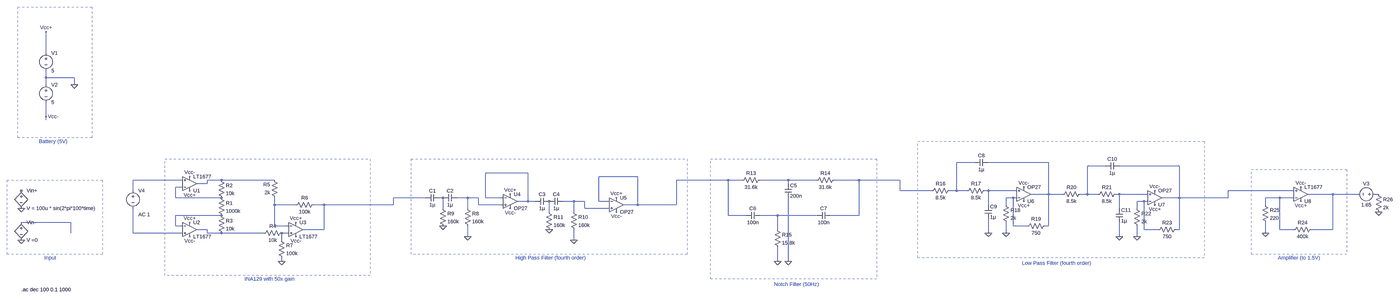
[diagram p0: schematic Prototype1.asc, whole sheet]
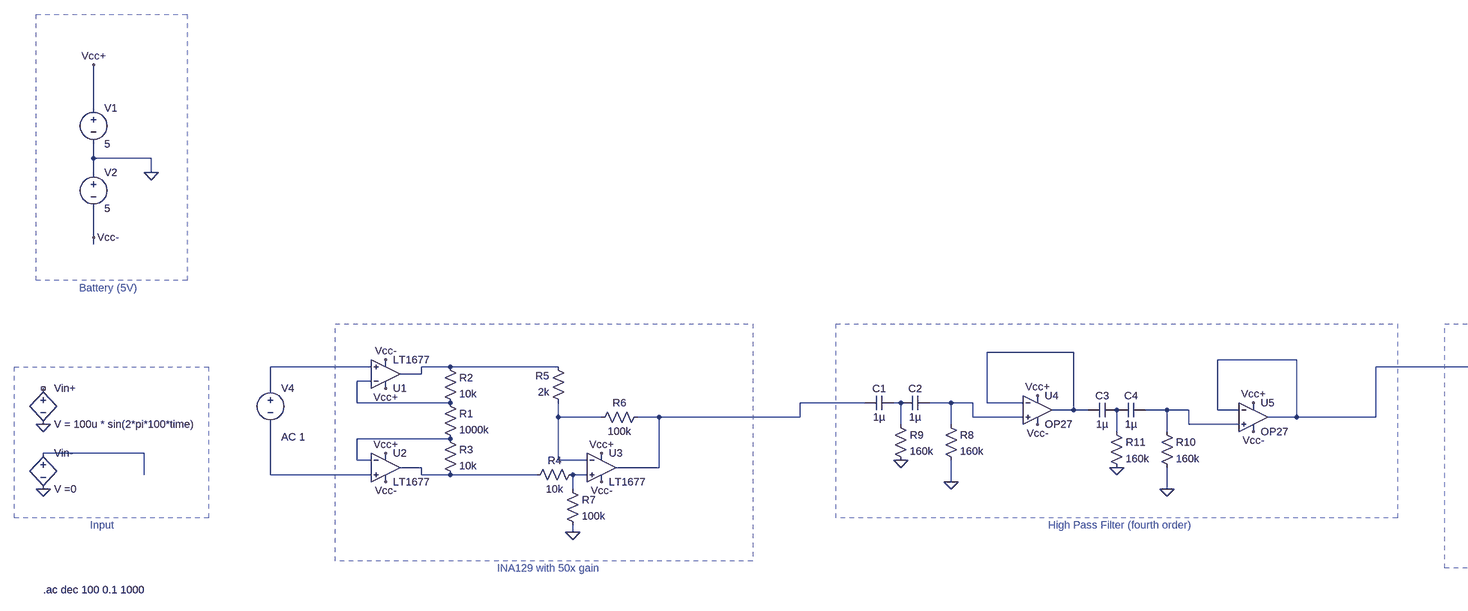
[diagram p1: schematic Prototype1.asc, part, row 1 of 1, column 1 of 2]
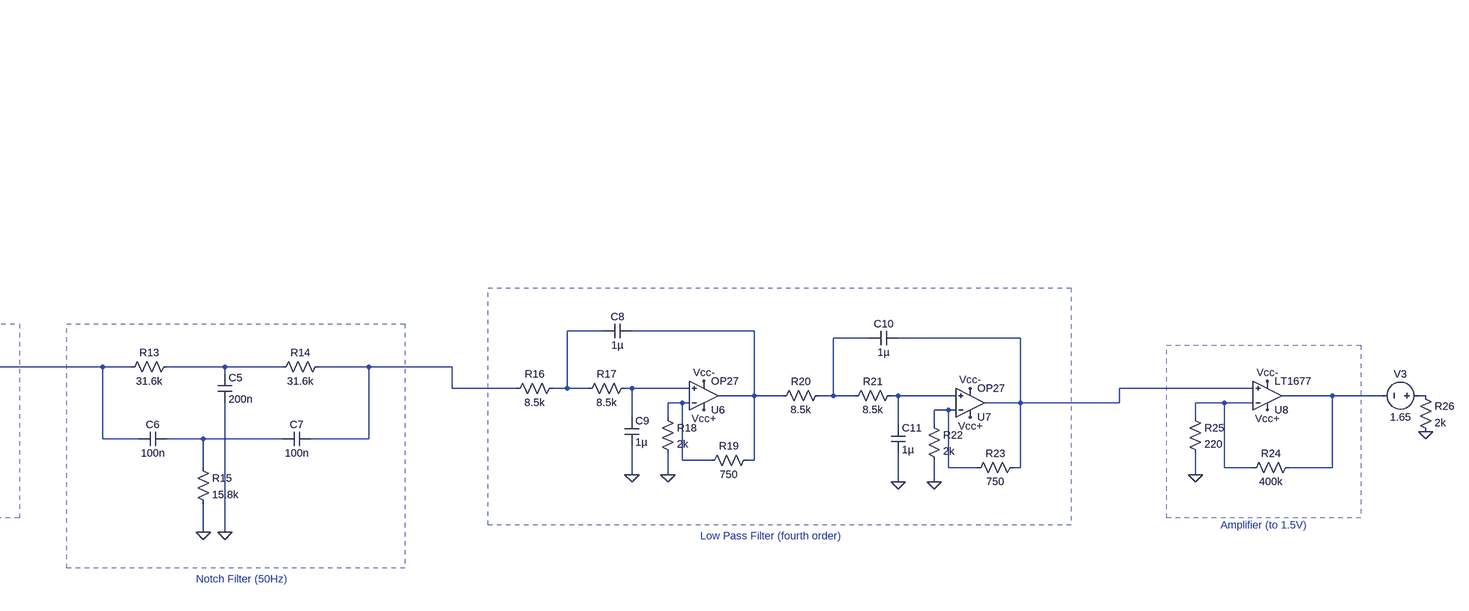
[diagram p2: schematic Prototype1.asc, part, row 1 of 1, column 2 of 2]
Prototype1.asc, the LTspice schematic file:
Version 4.1
SHEET 1 6180 680
WIRE -208 -640 -208 -736
WIRE -208 -528 -208 -560
WIRE -80 -528 -208 -528
WIRE -208 -496 -208 -528
WIRE -80 -496 -80 -528
WIRE -208 -352 -208 -416
WIRE -208 -336 -208 -352
WIRE 4160 -144 4080 -144
WIRE 4496 -144 4224 -144
WIRE 4752 -128 4672 -128
WIRE 5088 -128 4816 -128
WIRE 2064 -96 1872 -96
WIRE 2560 -80 2384 -80
WIRE 416 -64 192 -64
WIRE 592 -64 528 -64
WIRE 832 -64 592 -64
WIRE 3024 -64 2736 -64
WIRE 3088 -64 3024 -64
WIRE 3296 -64 3168 -64
WIRE 3424 -64 3296 -64
WIRE 3616 -64 3504 -64
WIRE 3824 -64 3616 -64
WIRE 528 -48 528 -64
WIRE 528 -48 480 -48
WIRE 3296 -48 3296 -64
WIRE 416 -32 384 -32
WIRE 192 -16 192 -64
WIRE 3824 -16 3824 -64
WIRE 3968 -16 3824 -16
WIRE 4080 -16 4080 -144
WIRE 4080 -16 4048 -16
WIRE 4128 -16 4080 -16
WIRE 4224 -16 4208 -16
WIRE 4352 -16 4224 -16
WIRE 5728 -16 5344 -16
WIRE 4496 0 4496 -144
WIRE 4496 0 4416 0
WIRE 4560 0 4496 0
WIRE 4672 0 4672 -128
WIRE 4672 0 4640 0
WIRE 4720 0 4672 0
WIRE 4816 0 4800 0
WIRE 4944 0 4816 0
WIRE 5904 0 5792 0
WIRE 6016 0 5904 0
WIRE 6112 0 6096 0
WIRE 384 16 384 -32
WIRE 592 16 384 16
WIRE 1600 16 1456 16
WIRE 1680 16 1664 16
WIRE 1792 16 1744 16
WIRE 1840 16 1792 16
WIRE 1872 16 1872 -96
WIRE 1952 16 1872 16
WIRE 4336 16 4304 16
WIRE 4352 16 4336 16
WIRE 5088 16 5088 -128
WIRE 5088 16 5008 16
WIRE 5344 16 5344 -16
WIRE 5344 16 5088 16
WIRE 5664 16 5600 16
WIRE 5728 16 5664 16
WIRE 2064 32 2064 -96
WIRE 2064 32 2016 32
WIRE 2096 32 2064 32
WIRE 2272 32 2224 32
WIRE 2320 32 2272 32
WIRE 2384 32 2384 -80
WIRE 2432 32 2384 32
WIRE 4928 32 4896 32
WIRE 4944 32 4928 32
WIRE 832 48 832 16
WIRE 928 48 832 48
WIRE 1056 48 1008 48
WIRE 1456 48 1456 16
WIRE 1456 48 1056 48
WIRE 1840 48 1840 16
WIRE 1952 48 1840 48
WIRE 2560 48 2560 -80
WIRE 2560 48 2496 48
WIRE 2736 48 2736 -64
WIRE 2736 48 2560 48
WIRE 4224 48 4224 -16
WIRE 4304 48 4304 16
WIRE 5600 48 5600 16
WIRE 1680 64 1680 16
WIRE 1792 64 1792 16
WIRE 2320 64 2320 32
WIRE 2432 64 2320 64
WIRE 4816 64 4816 0
WIRE 4896 64 4896 32
WIRE 2160 80 2160 32
WIRE 2272 80 2272 32
WIRE 592 96 384 96
WIRE 3024 96 3024 -64
WIRE 3104 96 3024 96
WIRE 3248 96 3168 96
WIRE 3424 96 3248 96
WIRE 3616 96 3616 -64
WIRE 3616 96 3488 96
WIRE -96 128 -320 128
WIRE 384 144 384 96
WIRE 416 144 384 144
WIRE 832 144 832 48
WIRE 896 144 832 144
WIRE 4336 144 4336 16
WIRE 4400 144 4336 144
WIRE 4496 144 4496 0
WIRE 4496 144 4480 144
WIRE 528 160 480 160
WIRE 1056 160 1056 48
WIRE 1056 160 960 160
WIRE 3248 160 3248 96
WIRE 4928 160 4928 32
WIRE 4992 160 4928 160
WIRE 5088 160 5088 16
WIRE 5088 160 5072 160
WIRE 5664 160 5664 16
WIRE 5728 160 5664 160
WIRE 5904 160 5904 0
WIRE 5904 160 5808 160
WIRE -96 176 -96 128
WIRE 192 176 192 64
WIRE 416 176 192 176
WIRE 528 176 528 160
WIRE 592 176 528 176
WIRE 784 176 592 176
WIRE 896 176 864 176
WIRE 4224 176 4224 112
WIRE 4304 176 4304 128
WIRE 5600 176 5600 128
WIRE 1792 192 1792 144
WIRE 4816 192 4816 128
WIRE 4896 192 4896 144
WIRE 864 208 864 176
WIRE 2272 208 2272 160
WIRE 864 304 864 288
WIRE 3248 304 3248 240
WIRE 3296 304 3296 16
FLAG -320 64 0
FLAG -320 208 0
FLAG -80 -496 0
FLAG -208 -736 Vcc+
FLAG 448 -16 Vcc+
FLAG 448 128 Vcc+
FLAG 928 128 Vcc+
FLAG -208 -352 Vcc-
FLAG 448 -80 Vcc-
FLAG 928 192 Vcc-
FLAG 448 192 Vcc-
FLAG 864 304 0
FLAG 1792 192 0
FLAG 2272 208 0
FLAG 1984 0 Vcc+
FLAG 2464 16 Vcc+
FLAG 1984 64 Vcc-
FLAG 2464 80 Vcc-
FLAG 3248 304 0
FLAG 3296 304 0
FLAG 4224 176 0
FLAG 4304 176 0
FLAG 4384 32 Vcc+
FLAG 4384 -32 Vcc-
FLAG 4816 192 0
FLAG 4896 192 0
FLAG 4976 48 Vcc+
FLAG 4976 -16 Vcc-
FLAG 5600 176 0
FLAG 5760 -32 Vcc-
FLAG 5760 32 Vcc+
FLAG 6112 80 0
FLAG 1680 144 0
FLAG 2160 160 0
SYMBOL bv -320 -32 R0
SYMATTR InstName Vin+
SYMATTR Value V = 100u * sin(2*pi*100*time)
SYMBOL bv -320 112 R0
SYMATTR InstName Vin-
SYMATTR Value V =0
SYMBOL OpAmps\\LT1677 448 16 M180
SYMATTR InstName U1
SYMBOL OpAmps\\LT1677 448 96 R0
SYMATTR InstName U2
SYMBOL OpAmps\\LT1677 928 96 R0
SYMATTR InstName U3
SYMBOL voltage -208 -656 R0
SYMATTR InstName V1
SYMATTR Value 5
SYMBOL voltage -208 -512 R0
SYMATTR InstName V2
SYMATTR Value 5
SYMBOL res 576 0 R0
SYMATTR InstName R1
SYMATTR Value 1000k
SYMBOL res 576 -80 R0
SYMATTR InstName R2
SYMATTR Value 10k
SYMBOL res 576 80 R0
SYMATTR InstName R3
SYMATTR Value 10k
SYMBOL res 880 160 R90
WINDOW 0 0 56 VBottom 2
WINDOW 3 32 56 VTop 2
SYMATTR InstName R4
SYMATTR Value 10k
SYMBOL res 848 32 R180
WINDOW 0 36 76 Left 2
WINDOW 3 36 40 Left 2
SYMATTR InstName R5
SYMATTR Value 2k
SYMBOL res 1024 32 R90
WINDOW 0 0 56 VBottom 2
WINDOW 3 32 56 VTop 2
SYMATTR InstName R6
SYMATTR Value 100k
SYMBOL res 848 192 R0
SYMATTR InstName R7
SYMATTR Value 100k
SYMBOL cap 1664 0 R90
WINDOW 0 0 32 VBottom 2
WINDOW 3 32 32 VTop 2
SYMATTR InstName C1
SYMATTR Value 1µ
SYMBOL cap 1744 0 R90
WINDOW 0 0 32 VBottom 2
WINDOW 3 32 32 VTop 2
SYMATTR InstName C2
SYMATTR Value 1µ
SYMBOL OpAmps\\OP27 1984 -32 R0
SYMATTR InstName U4
SYMBOL res 1776 48 R0
SYMATTR InstName R8
SYMATTR Value 160k
SYMBOL cap 2160 16 R90
WINDOW 0 0 32 VBottom 2
WINDOW 3 32 32 VTop 2
SYMATTR InstName C3
SYMATTR Value 1µ
SYMBOL cap 2224 16 R90
WINDOW 0 0 32 VBottom 2
WINDOW 3 32 32 VTop 2
SYMATTR InstName C4
SYMATTR Value 1µ
SYMBOL OpAmps\\OP27 2464 -16 R0
SYMATTR InstName U5
SYMBOL res 2256 64 R0
SYMATTR InstName R10
SYMATTR Value 160k
SYMBOL res 3184 -80 R90
WINDOW 0 0 56 VBottom 2
WINDOW 3 32 56 VTop 2
SYMATTR InstName R13
SYMATTR Value 31.6k
SYMBOL res 3520 -80 R90
WINDOW 0 0 56 VBottom 2
WINDOW 3 32 56 VTop 2
SYMATTR InstName R14
SYMATTR Value 31.6k
SYMBOL cap 3280 -48 R0
SYMATTR InstName C5
SYMATTR Value 200n
SYMBOL cap 3168 80 R90
WINDOW 0 0 32 VBottom 2
WINDOW 3 32 32 VTop 2
SYMATTR InstName C6
SYMATTR Value 100n
SYMBOL cap 3488 80 R90
WINDOW 0 0 32 VBottom 2
WINDOW 3 32 32 VTop 2
SYMATTR InstName C7
SYMATTR Value 100n
SYMBOL res 3232 144 R0
SYMATTR InstName R15
SYMATTR Value 15.8k
SYMBOL OpAmps\\OP27 4384 64 M180
SYMATTR InstName U6
SYMBOL res 4064 -32 R90
WINDOW 0 0 56 VBottom 2
WINDOW 3 32 56 VTop 2
SYMATTR InstName R16
SYMATTR Value 8.5k
SYMBOL res 4224 -32 R90
WINDOW 0 0 56 VBottom 2
WINDOW 3 32 56 VTop 2
SYMATTR InstName R17
SYMATTR Value 8.5k
SYMBOL cap 4224 -160 R90
WINDOW 0 0 32 VBottom 2
WINDOW 3 32 32 VTop 2
SYMATTR InstName C8
SYMATTR Value 1µ
SYMBOL cap 4208 48 R0
SYMATTR InstName C9
SYMATTR Value 1µ
SYMBOL res 4288 32 R0
SYMATTR InstName R18
SYMATTR Value 2k
SYMBOL res 4496 128 R90
WINDOW 0 0 56 VBottom 2
WINDOW 3 32 56 VTop 2
SYMATTR InstName R19
SYMATTR Value 750
SYMBOL OpAmps\\OP27 4976 80 M180
SYMATTR InstName U7
SYMBOL res 4656 -16 R90
WINDOW 0 0 56 VBottom 2
WINDOW 3 32 56 VTop 2
SYMATTR InstName R20
SYMATTR Value 8.5k
SYMBOL res 4816 -16 R90
WINDOW 0 0 56 VBottom 2
WINDOW 3 32 56 VTop 2
SYMATTR InstName R21
SYMATTR Value 8.5k
SYMBOL cap 4816 -144 R90
WINDOW 0 0 32 VBottom 2
WINDOW 3 32 32 VTop 2
SYMATTR InstName C10
SYMATTR Value 1µ
SYMBOL cap 4800 64 R0
SYMATTR InstName C11
SYMATTR Value 1µ
SYMBOL res 4880 48 R0
SYMATTR InstName R22
SYMATTR Value 2k
SYMBOL res 5088 144 R90
WINDOW 0 0 56 VBottom 2
WINDOW 3 32 56 VTop 2
SYMATTR InstName R23
SYMATTR Value 750
SYMBOL OpAmps\\LT1677 5760 64 M180
SYMATTR InstName U8
SYMBOL res 5824 144 R90
WINDOW 0 0 56 VBottom 2
WINDOW 3 32 56 VTop 2
SYMATTR InstName R24
SYMATTR Value 400k
SYMBOL res 5584 32 R0
SYMATTR InstName R25
SYMATTR Value 220
SYMBOL res 6096 -16 R0
SYMATTR InstName R26
SYMATTR Value 2k
SYMBOL res 1664 48 R0
SYMATTR InstName R9
SYMATTR Value 160k
SYMBOL res 2144 64 R0
SYMATTR InstName R11
SYMATTR Value 160k
SYMBOL voltage 6112 0 R90
WINDOW 0 -32 56 VBottom 2
WINDOW 3 32 56 VTop 2
SYMATTR InstName V3
SYMATTR Value 1.65
SYMBOL voltage 192 -32 R0
WINDOW 123 24 124 Left 2
WINDOW 39 0 0 Left 0
SYMATTR InstName V4
SYMATTR Value ""
SYMATTR Value2 AC 1
TEXT -216 288 Left 2 ;Input
TEXT -240 -240 Left 2 ;Battery (5V)
TEXT 696 384 Left 2 ;INA129 with 50x gain
TEXT 2008 288 Left 2 ;High Pass Filter (fourth order)
TEXT 3232 408 Left 2 ;Notch Filter (50Hz)
TEXT 4376 312 Left 2 ;Low Pass Filter (fourth order)
TEXT 5656 288 Left 2 ;Amplifier (to 1.5V)
TEXT -320 432 Left 2 !.ac dec 100 0.1 1000
RECTANGLE Normal 48 272 -384 -64 2
RECTANGLE Normal 48 272 -384 -64 1
RECTANGLE Normal 0 -256 -336 -848 1
RECTANGLE Normal 1264 368 336 -160 1
RECTANGLE Normal 2784 272 1536 -160 1
RECTANGLE Normal 3696 384 2944 -160 1
RECTANGLE Normal 5200 288 3904 -240 1
RECTANGLE Normal 5968 272 5536 -112 1

The netlist it stands for:
* Prototype1.asc
B§Vin+ NC_01 0 V = 100u * sin(2*pi*100*time)
B§Vin- N027 0 V =0
X§U1 N007 N011 Vcc+ Vcc- N008 LT1677  ; pins In+ In- V+ V- OUT
X§U2 N029 N025 Vcc+ Vcc- N028 LT1677  ; pins In+ In- V+ V- OUT
X§U3 N030 N023 Vcc+ Vcc- N016 LT1677  ; pins In+ In- V+ V- OUT
V1 Vcc+ 0 5
V2 0 Vcc- 5
R1 N011 N025 1000k
R2 N008 N011 10k
R3 N025 N028 10k
R4 N030 N028 10k
R5 N023 N008 2k
R6 N016 N023 100k
R7 N030 0 100k
C1 N017 N016 1µ
C2 N018 N017 1µ
X§U4 N018 N005 Vcc+ Vcc- N005 OP27  ; pins In+ In- V+ V- OUT
R8 N018 0 160k
C3 N024 N005 1µ
C4 N021 N024 1µ
X§U5 N021 N006 Vcc+ Vcc- N006 OP27  ; pins In+ In- V+ V- OUT
R10 N021 0 160k
R13 N009 N006 31.6k
R14 N010 N009 31.6k
C5 N009 0 200n
C6 N026 N006 100n
C7 N010 N026 100n
R15 N026 0 15.8k
X§U6 N012 N019 Vcc+ Vcc- N002 OP27  ; pins In+ In- V+ V- OUT
R16 N001 N010 8.5k
R17 N012 N001 8.5k
C8 N002 N001 1µ
C9 N012 0 1µ
R18 N019 0 2k
R19 N002 N019 750
X§U7 N013 N022 Vcc+ Vcc- N004 OP27  ; pins In+ In- V+ V- OUT
R20 N003 N002 8.5k
R21 N013 N003 8.5k
C10 N004 N003 1µ
C11 N013 0 1µ
R22 N022 0 2k
R23 N004 N022 750
X§U8 N004 N020 Vcc+ Vcc- N014 LT1677  ; pins In+ In- V+ V- OUT
R24 N014 N020 400k
R25 N020 0 220
R26 N015 0 2k
R9 N017 0 160k
R11 N024 0 160k
V3 N015 N014 1.65
V4 N007 N029 AC 1
* Input
* Battery (5V)
* INA129 with 50x gain
* High Pass Filter (fourth order)
* Notch Filter (50Hz)
* Low Pass Filter (fourth order)
* Amplifier (to 1.5V)
.ac dec 100 0.1 1000
.lib LTC.lib
.lib ADI.lib
.backanno
.end